# Altium schematic sheet ECG_NEMO_final_V1B_main_stack1_fix.schdoc
size A4
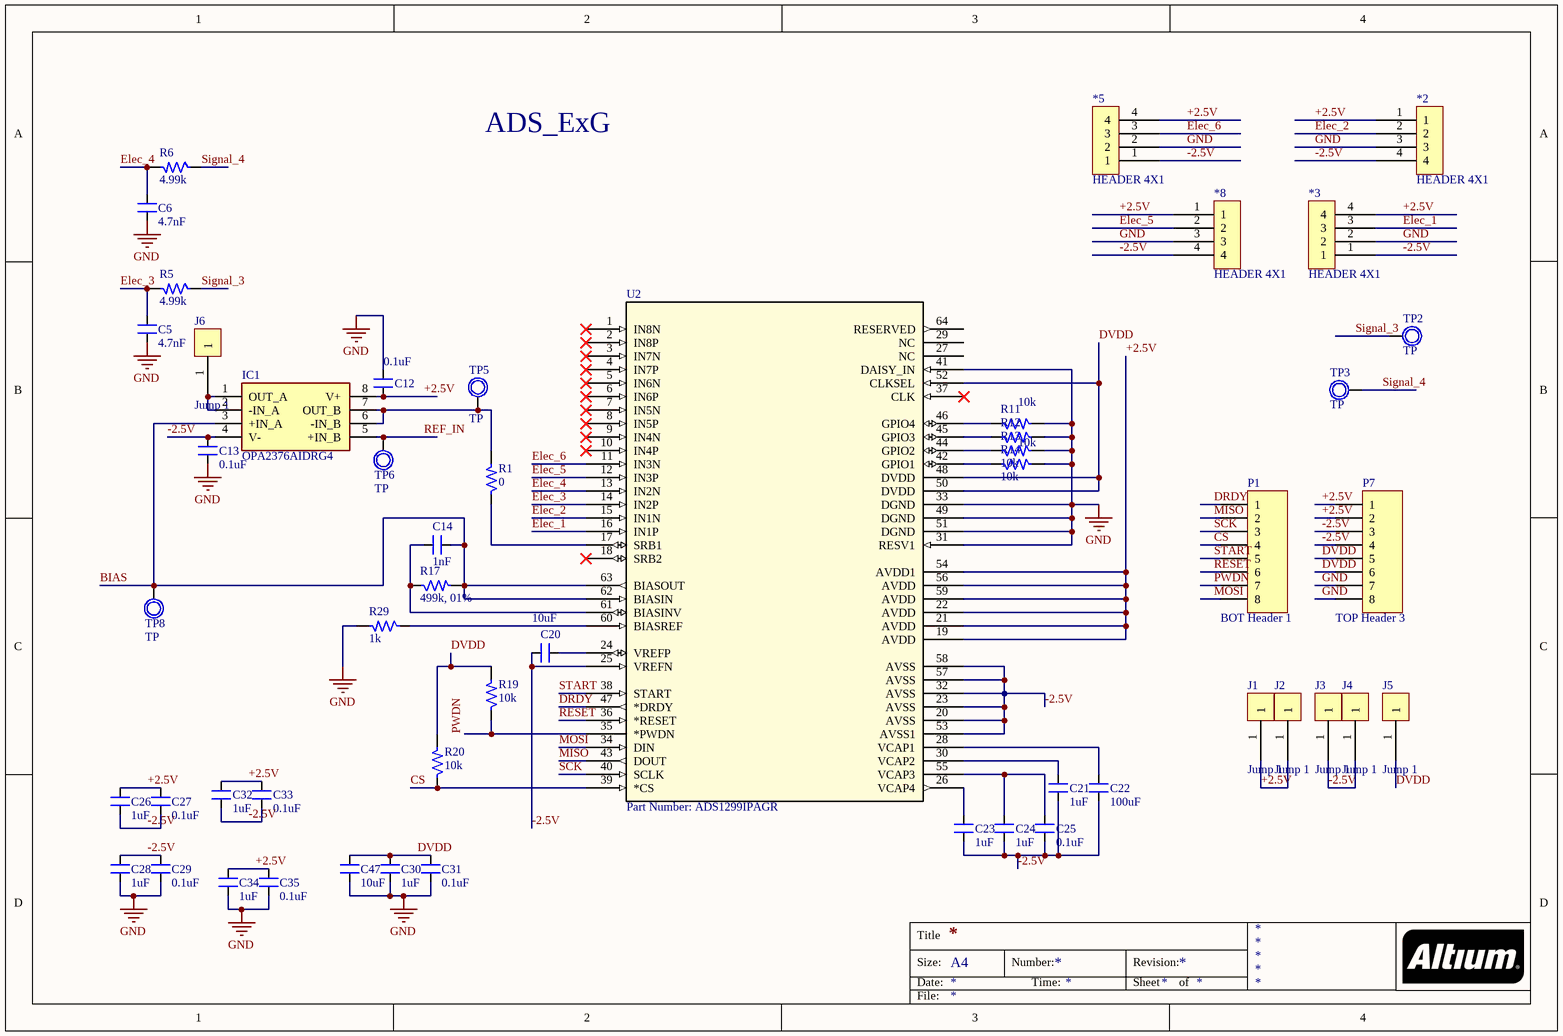
[diagram p0: ECG_NEMO_final_V1B_main_stack1_fix.schdoc]

## Parts
*2  HEADER 4X1  [HEADER4X1]
*3  HEADER 4X1  [HEADER4X1]
*5  HEADER 4X1  [HEADER4X1]
*8  HEADER 4X1  [HEADER4X1]
C5  4.7nF  [SM-0805]
C6  4.7nF  [SM-0805]
C12  0.1uF  [SM-0805]
C13  0.1uF  [SM-0805]
C14  1nF  [SM-0805]
C20  10uF  [SM-0805]
C21  1uF  [SM-0805]
C22  100uF  [SM-0805]
C23  1uF  [SM-0805]
C24  1uF  [SM-0805]
C25  0.1uF  [SM-0805]
C26  1uF  [SM-0805]
C27  0.1uF  [SM-0805]
C28  1uF  [SM-0805]
C29  0.1uF  [SM-0805]
C30  1uF  [SM-0805]
C31  0.1uF  [SM-0805]
C32  1uF  [SM-0805]
C33  0.1uF  [SM-0805]
C34  1uF  [SM-0805]
C35  0.1uF  [SM-0805]
C47  10uF  [SM-0805]
IC1  OPA2376AIDRG4  [SOIC127P600X175-8N]
J1  Jump 1  [PCBComponent_1]
J2  Jump 1  [PCBComponent_1]
J3  Jump 1  [PCBComponent_1]
J4  Jump 1  [PCBComponent_1]
J5  Jump 1  [PCBComponent_1]
J6  Jump 1  [PCBComponent_1]
P1  BOT Header 1  [HDR1X8]
P7  TOP Header 3  [HDR1X8]
R1  0  [SM-0805]
R5  4.99k  [SM-0805]
R6  4.99k  [SM-0805]
R11  10k  [SM-0805]
R12  10k  [SM-0805]
R13  10k  [SM-0805]
R14  10k  [SM-0805]
R17  499k, 01%  [SM-0805]
R19  10k  [SM-0805]
R20  10k  [SM-0805]
R29  1k  [SM-0805]
TP2  TP  [TP1]
TP3  TP  [TP1]
TP5  TP  [TP1]
TP6  TP  [TP1]
TP8  TP  [TP1]
U2  Part Number: ADS1299IPAGR  [QFP50P1200X1200X120-64N]

## Nets
GND: *2.3 *3.2 *5.2 *8.3 C5.1 C6.1 C12.2 C13.1 C28.1 C29.1 C30.1 C31.1 C34.1 C35.1 C47.1 P7.7 P7.8 R11.2 R12.2 R13.2 R14.2 R29.2 U2.31(RESV1) U2.33(DGND) U2.41(DAISY_IN) U2.49(DGND) U2.51(DGND)
+2.5V: *2.1 *3.4 *5.4 *8.1 C12.1 C26.2 C27.2 C32.2 C33.2 C34.2 C35.2 IC1.8(V+) J1.1 J2.1 P7.1 P7.2 U2.19(AVDD) U2.21(AVDD) U2.22(AVDD) U2.54(AVDD1) U2.56(AVDD) U2.59(AVDD)
-2.5V: *2.4 *3.1 *5.1 *8.4 C13.2 C20.2 C21.1 C22.2 C23.1 C24.1 C25.1 C26.1 C27.1 C28.2 C29.2 C32.1 C33.1 IC1.4(V-) J3.1 J4.1 P7.3 P7.4 U2.20(AVSS) U2.23(AVSS) U2.25(VREFN) U2.32(AVSS) U2.53(AVSS1) U2.57(AVSS) U2.58(AVSS)
BIAS: C14.2 IC1.3(+IN_A) R17.2 TP8.1 U2.62(BIASIN) U2.63(BIASOUT)
CS: P1.4 R20.1 U2.39(*CS)
DRDY: P1.1 U2.47(*DRDY)
DVDD: C30.2 C31.2 C47.2 J5.1 P7.5 P7.6 R19.2 R20.2 U2.48(DVDD) U2.50(DVDD) U2.52(CLKSEL)
Elec_1: *3.3 U2.16(IN1P)
Elec_2: *2.2 U2.15(IN1N)
Elec_3: C5.2 R5.2 U2.14(IN2P)
Elec_4: C6.2 R6.2 U2.13(IN2N)
Elec_5: *8.2 U2.12(IN3P)
Elec_6: *5.3 U2.11(IN3N)
MISO: P1.2 U2.43(DOUT)
MOSI: P1.8 U2.34(DIN)
PWDN: P1.7 R19.1 U2.35(*PWDN)
REF_IN: IC1.5(+IN_B) TP6.1
RESET: P1.6 U2.36(*RESET)
SCK: P1.3 U2.40(SCLK)
Signal_3: R5.1 TP2.1
Signal_4: R6.1 TP3.1
START: P1.5 U2.38(START)
NetC14_1: C14.1 R17.1 U2.61(BIASINV)
NetC20_1: C20.1 U2.24(VREFP)
NetC21_2: C21.2 U2.30(VCAP2)
NetC22_1: C22.1 U2.28(VCAP1)
NetC23_2: C23.2 U2.26(VCAP4)
NetC24_2: C24.2 C25.2 U2.55(VCAP3)
NetIC1_1: IC1.1(OUT_A) IC1.2(-IN_A) J6.1
NetIC1_6: IC1.6(-IN_B) IC1.7(OUT_B) R1.2 TP5.1
NetR1_1: R1.1 U2.17(SRB1)
NetR11_1: R11.1 U2.46(GPIO4)
NetR12_1: R12.1 U2.45(GPIO3)
NetR13_1: R13.1 U2.44(GPIO2)
NetR14_1: R14.1 U2.42(GPIO1)
NetR29_1: R29.1 U2.60(BIASREF)

Not connected (* = marked no-connect by the designer): U2 1(IN8N)* 2(IN8P)* 3(IN7N)* 4(IN7P)* 5(IN6N)* 6(IN6P)* 7(IN5N)* 8(IN5P)* 9(IN4N)* 10(IN4P)* 18(SRB2)* 27(NC) 29(NC) 37(CLK)* 64(RESERVED)

## Notes on the sheet
- ADS_ExG
- Title
- Size:
- Date:
- A4
- Number:
- Time:
- Revision:
- Sheet
- of
- File:

## Library data of the parts
C5 C6 C12-C14 C20-C35 C47 = CM: Cap SMD; Value: 103
IC1 = OPA2376AIDRG4: Integrated Circuit; Manufacturer_Name: Texas Instruments; Datasheet Link: https://datasheet.datasheetarchive.com/originals/distributors/SFDatasheet-6/sf-000133686.pdf; Height: 1.75mm; Manufacturer_Part_Number: OPA2376AIDRG4; Mouser Part Number: 595-OPA2376AIDRG4; Mouser Price/Stock: https://www.mouser.co.uk/ProductDetail/Texas-Instruments/OPA2376AIDRG4?qs=IUbkBnfnSQIcJ9njy8NzUg%3D%3D; Arrow Part Number: OPA2376AIDRG4; Arrow Price/Stock: https://www.arrow.com/en/products/opa2376aidrg4/texas-instruments
J1-J6 = jump1
P1 P7 = Header 8: Header, 8-Pin; LatestRevisionDate: 17-Jul-2002; LatestRevisionNote: Re-released for DXP Platform.; Publisher: Altium Limited
R1 R5 R6 R11-R14 R17 R19 R20 R29 = R: Resistor 1/4W; Value: R1/4W - 1K
TP2 TP3 TP5 TP6 TP8 = TP1: Test Point; Value: Test Point
U2 = ADS1299IPAGR: No Description Available; Vendor: Texas Instruments; Built_By: EMA_UL_Team; Manufacturer_Part_Number: ADS1299IPAGR; Copyright: Copyright (C) 2018 Accelerated Designs. All rights reserved; RefDes: RefDes; Type: DEV; Value: Value